# Altium schematic sheet 02_Block_Diagram.SchDoc
size A3; SheetNumber: 2; SheetTotal: 8
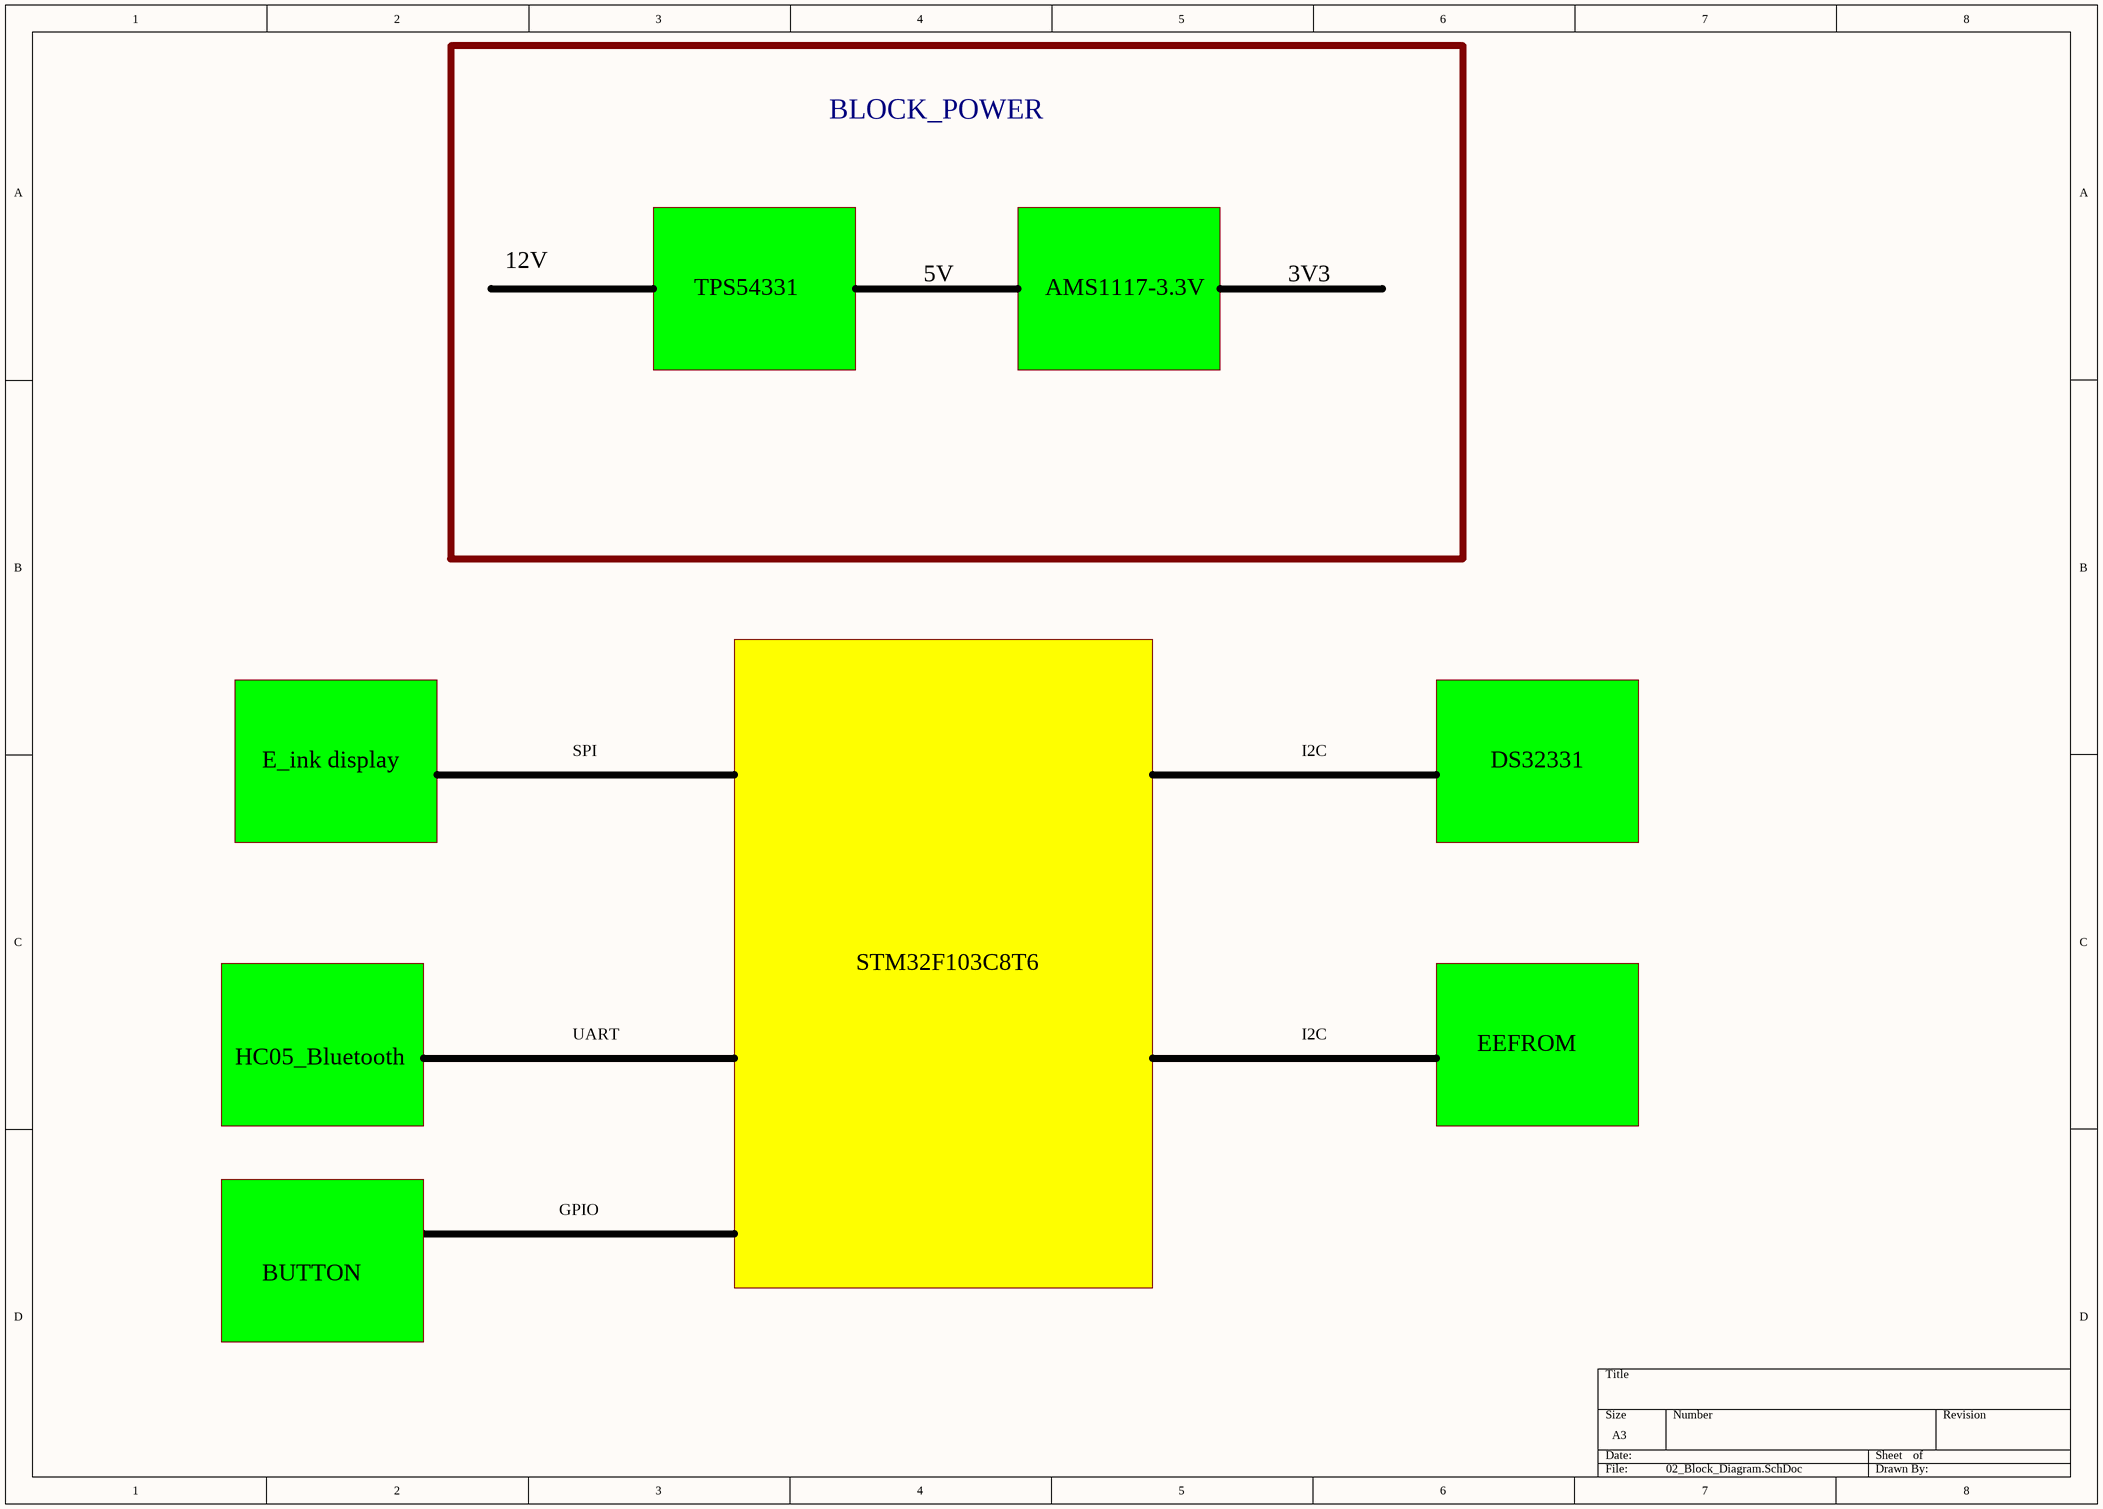
[diagram p0: 02_Block_Diagram.SchDoc]

## Notes on the sheet
- BLOCK_POWER
- 12V
- TPS54331
- 5V
- AMS1117-3.3V
- 3V3
- E_ink display
- SPI
- I2C
- DS32331
- STM32F103C8T6
- UART
- EEFROM
- HC05_Bluetooth
- GPIO
- BUTTON